# Altium project ovencontrol_0v2.PrjPCB
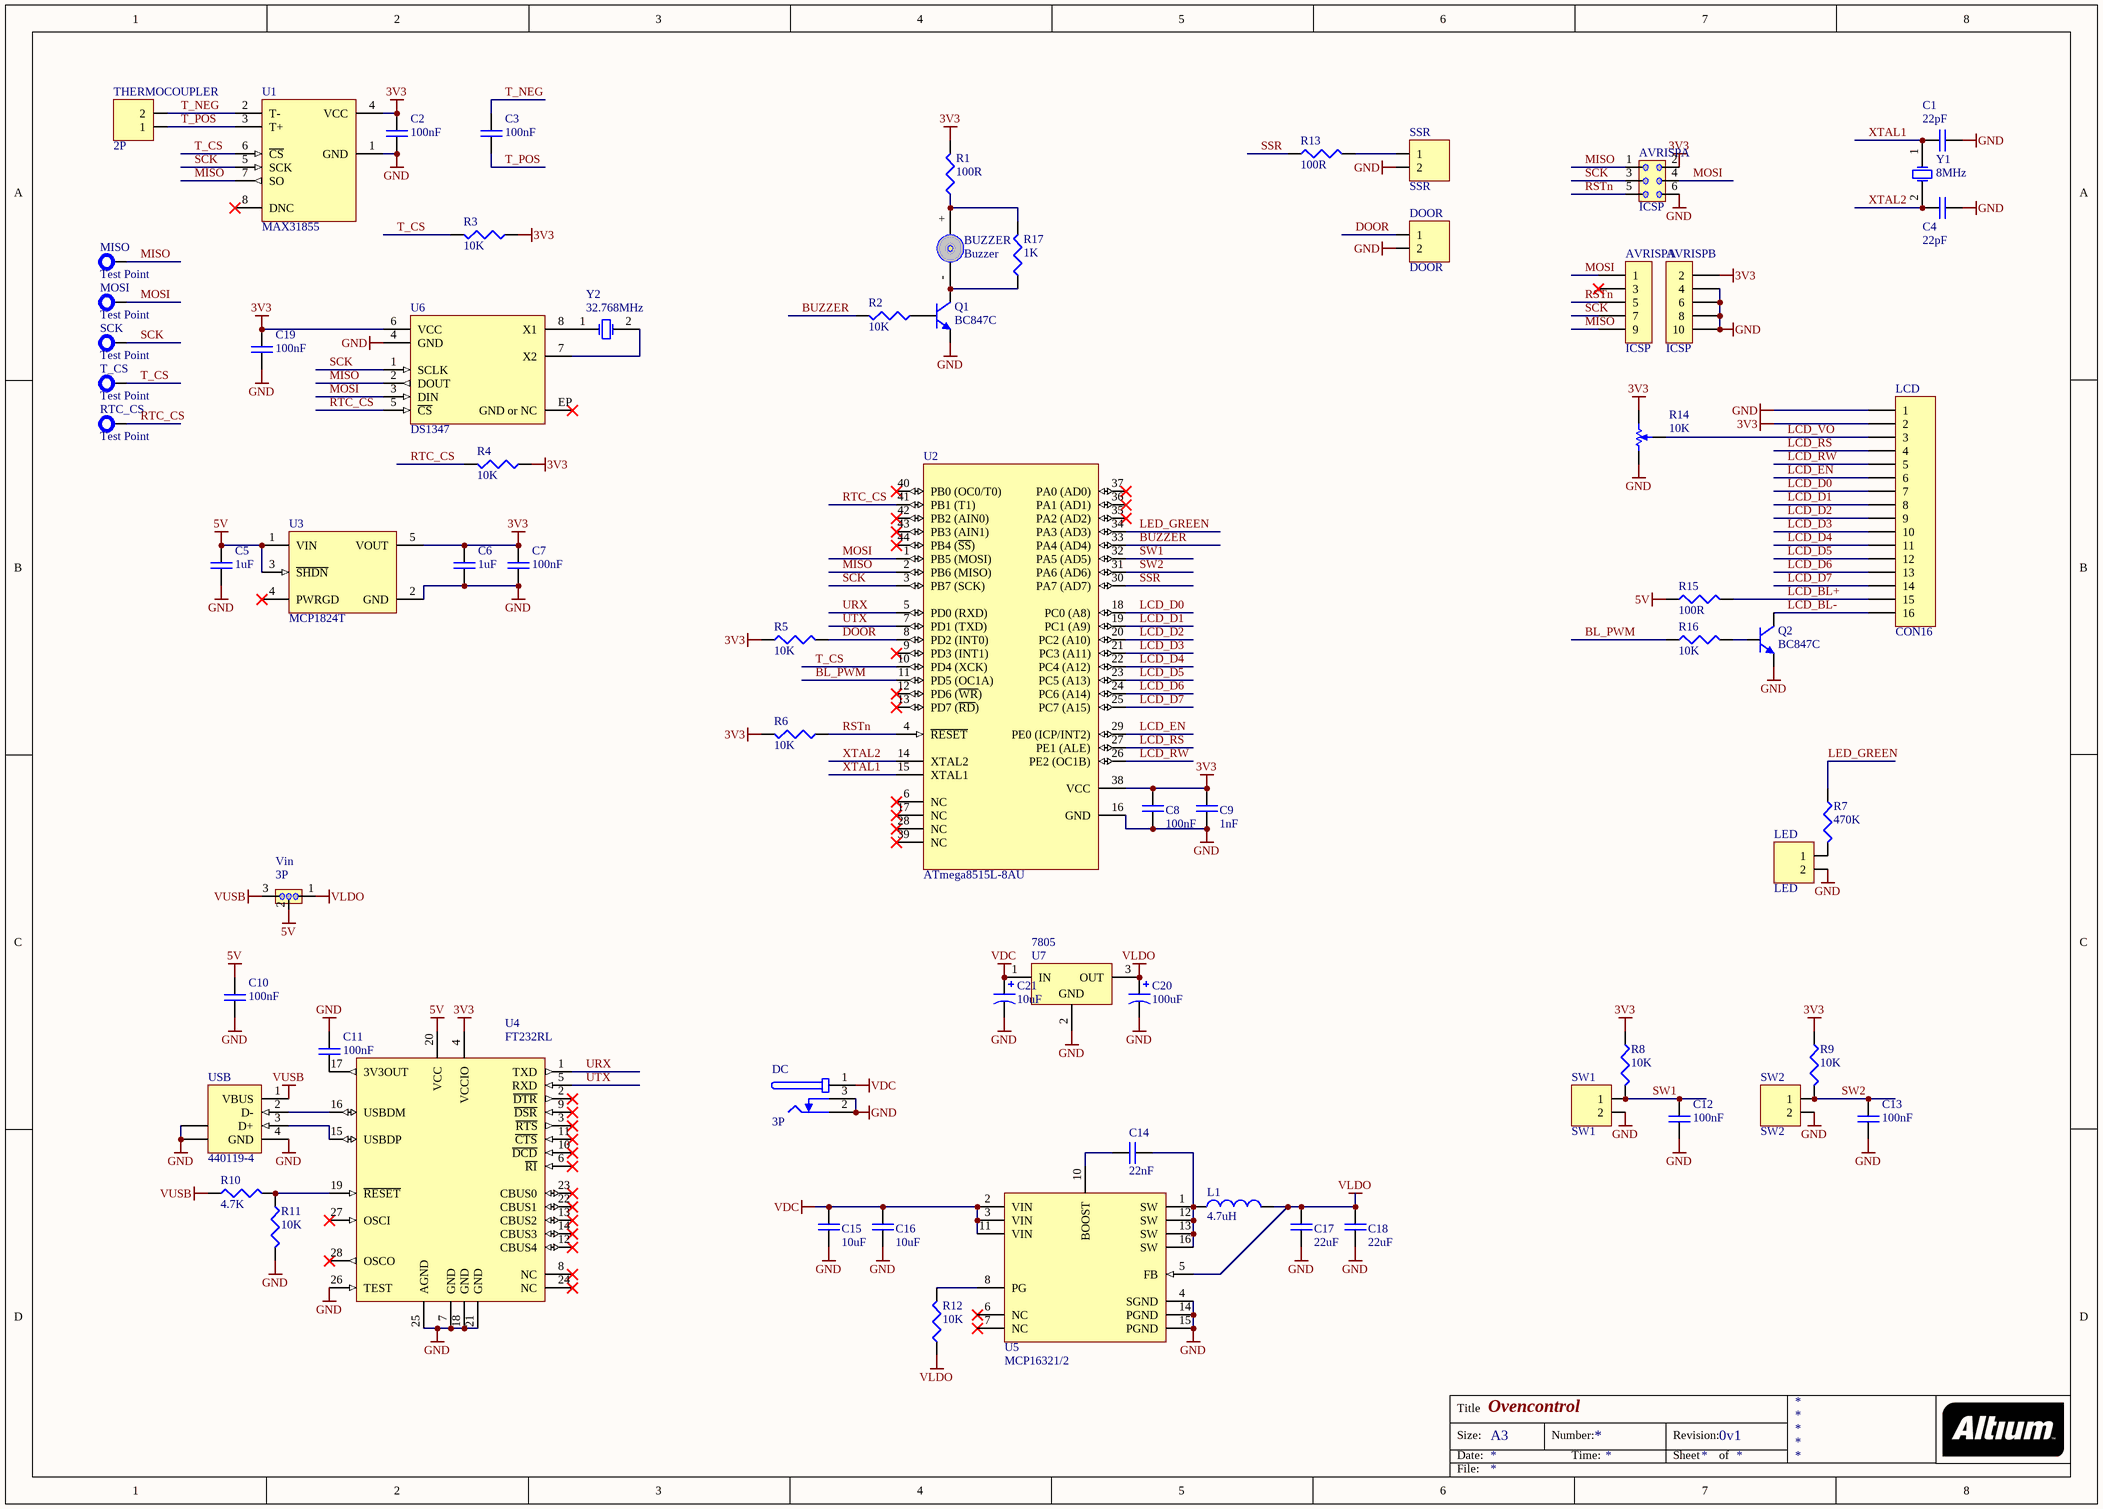
[diagram p0: ovencontrol.SchDoc]
1 sheet, 68 parts. Net scope: global (net labels, ports and power ports of the same name join across sheets).
Board file: ovencontrol.PcbDoc

## Sheet ovencontrol.SchDoc: Ovencontrol
size A3; Revision: 0v1; PageSetup: Record=PageOptions|CenterHorizontal=True|CenterVertical=True|PrintScale=1.00|XCorrection=1.00|YCorrection=1.00|PrintKind=1|BorderSize=5000000|LeftOffset=0|BottomOffset=0|Orientation=2|PaperLength=1000|PaperWidth=1000|Scale=100|PaperSource=7|PrintQuality=-4|MediaType=1|DitherType=10|PaperKind=A3|PrintScaleMode=1

### Parts
(Parts that share a designator on the sheet are numbered #1, #2 ... from top to bottom, then left to right.)
AVRISP#1  ICSP  [DIL-6]  (part A of 3)
AVRISP#2  ICSP  [IDC-10]  (parts A,B of 2)
BUZZER  Buzzer  [Buzzer_12mm]
C1  22pF  [0603]
C2  100nF  [0603]
C3  100nF  [0603]
C4  22pF  [0603]
C5  1uF  [0603]
C6  1uF  [0603]
C7  100nF  [0603]
C8  100nF  [0603]
C9  1nF  [0603]
C10  100nF  [0603]
C11  100nF  [0603]
C12  100nF  [0603]
C13  100nF  [0603]
C14  22nF  [0603]
C15  10uF  [0805]
C16  10uF  [0805]
C17  22uF  [0805]
C18  22uF  [0805]
C19  100nF  [0603]
C20  100uF  [RADIAL-2.5MM]
C21  10uF  [RADIAL-2.5MM]
DC  3P  [JACKPOW/PD-2.5MM-TH]
DOOR  DOOR  [SIP-2]
L1  4.7uH  [1210]
LCD  CON16  [HDR2X8]
LED  LED  [SIP-2]
MISO  Test Point  [TERMINAL]  (no BOM)
MOSI  Test Point  [TERMINAL]  (no BOM)
Q1  BC847C  [SOT-23@BEC]
Q2  BC847C  [SOT-23@BEC]
R1  100R  [0603]
R2  10K  [0603]
R3  10K  [0603]
R4  10K  [0603]
R5  10K  [0603]
R6  10K  [0603]
R7  470K  [0603]
R8  10K  [0603]
R9  10K  [0603]
R10  4.7K  [0603]
R11  10K  [0603]
R12  10K  [0603]
R13  100R  [0603]
R14  10K  [POT4MM-2]
R15  100R  [0603]
R16  10K  [0603]
R17  1K  [0603]
RTC_CS  Test Point  [TERMINAL]  (no BOM)
SCK  Test Point  [TERMINAL]  (no BOM)
SSR  SSR  [INTERLOCK2-5MM]
SW1  SW1  [SIP-2]
SW2  SW2  [SIP-2]
T_CS  Test Point  [TERMINAL]  (no BOM)
THERMOCOUPLER  2P  [INTERLOCK2-5MM]
U1  MAX31855  [SOIC-8]
U2  ATmega8515L-8AU  [TQFP-44]
U3  MCP1824T  [SOT-23-5]
U4  FT232RL  [SSOP-28]
U5  MCP16321/2  [QFN50P300X300-16V4L]
U6  DS1347  [TDFN-8]
U7  7805  [TO-220]
USB  440119-4  [440119]
Vin  3P  [SIP-3]
Y1  8MHz  [HC-49U]
Y2  32.768MHz  [XTAL-SMD-4.9x1.8]

### Nets
3V3: AVRISP#1.2 AVRISP#2.2 C2.1 C6.1 C7.1 C8.2 C9.2 C19.1 LCD.2 R1.2 R3.1 R4.1 R5.1 R6.1 R8.1 R9.1 R14.CW(+) U1.4(VCC) U2.38(VCC) U3.5(VOUT) U4.4(VCCIO) U6.6(VCC)
5V: C5.1 C10.1 R15.1 U3.1(VIN) U3.3(~{SHDN}) U4.20(VCC) Vin.2
GND: AVRISP#1.6 AVRISP#2.4 AVRISP#2.6 AVRISP#2.8 AVRISP#2.10 C1.1 C2.2 C4.1 C5.2 C6.2 C7.2 C8.1 C9.1 C10.2 C11.1 C12.2 C13.2 C15.2 C16.2 C17.2 C18.2 C19.2 C20.2(N) C21.2(N) DC.2 DC.3 DOOR.2 LCD.1 LED.2 Q1.E Q2.E R11.2 R14.CCW(-) SSR.2 SW1.2 SW2.2 U1.1(GND) U2.16(GND) U3.2(GND) U4.7(GND) U4.18(GND) U4.21(GND) U4.25(AGND) U4.26(TEST) U5.4(SGND) U5.14(PGND) U5.15(PGND) U6.4(GND) U7.2(GND) USB.4(GND) USB.5(SHLD) USB.6(SHLD)
VDC: C15.1 C16.1 C21.1(P) DC.1 U5.2(VIN) U5.3(VIN) U5.11(VIN) U7.1(IN)
VLDO: C17.1 C18.1 C20.1(P) L1.2 R12.2 U5.5(FB) U7.3(OUT) Vin.1
VUSB: R10.1 USB.1(VBUS) Vin.3
BL_PWM: R16.1 U2.11(PD5_(OC1A))
BUZZER: R2.2 U2.33(PA4_(AD4))
DOOR: DOOR.1 R5.2 U2.8(PD2_(INT0))
LCD_BL+: LCD.15 R15.2
LCD_BL-: LCD.16 Q2.C
LCD_D0: LCD.7 U2.18(PC0_(A8))
LCD_D1: LCD.8 U2.19(PC1_(A9))
LCD_D2: LCD.9 U2.20(PC2_(A10))
LCD_D3: LCD.10 U2.21(PC3_(A11))
LCD_D4: LCD.11 U2.22(PC4_(A12))
LCD_D5: LCD.12 U2.23(PC5_(A13))
LCD_D6: LCD.13 U2.24(PC6_(A14))
LCD_D7: LCD.14 U2.25(PC7_(A15))
LCD_EN: LCD.6 U2.29(PE0_(ICP/INT2))
LCD_RS: LCD.4 U2.27(PE1_(ALE))
LCD_RW: LCD.5 U2.26(PE2_(OC1B))
LCD_VO: LCD.3 R14.W
LED_GREEN: R7.1 U2.34(PA3_(AD3))
MISO: AVRISP#1.1 AVRISP#2.9 MISO.1(TP) U1.7(SO) U2.2(PB6_(MISO)) U6.2(DOUT)
MOSI: AVRISP#1.4 AVRISP#2.1 MOSI.1(TP) U2.1(PB5_(MOSI)) U6.3(DIN)
RSTn: AVRISP#1.5 AVRISP#2.5 R6.2 U2.4(~{RESET})
RTC_CS: R4.2 RTC_CS.1(TP) U2.41(PB1_(T1)) U6.5(~{CS})
SCK: AVRISP#1.3 AVRISP#2.7 SCK.1(TP) U1.5(SCK) U2.3(PB7_(SCK)) U6.1(SCLK)
SSR: R13.1 U2.30(PA7_(AD7))
SW1: C12.1 R8.2 SW1.1 U2.32(PA5_(AD5))
SW2: C13.1 R9.2 SW2.1 U2.31(PA6_(AD6))
T_CS: R3.2 T_CS.1(TP) U1.6(~{CS}) U2.10(PD4_(XCK))
T_NEG: C3.1 THERMOCOUPLER.2 U1.2(T-)
T_POS: C3.2 THERMOCOUPLER.1 U1.3(T+)
URX: U2.5(PD0_(RXD)) U4.1(TXD)
UTX: U2.7(PD1_(TXD)) U4.5(RXD)
XTAL1: C1.2 U2.15(XTAL1) Y1.1(OSC1)
XTAL2: C4.2 U2.14(XTAL2) Y1.2(OSC2)
NetBUZZER_+: BUZZER.+ R1.1 R17.2
NetBUZZER_-: BUZZER.- Q1.C R17.1
NetC11_2: C11.2 U4.17(3V3OUT)
NetC14_1: C14.1 U5.10(BOOST)
NetC14_2: C14.2 L1.1 U5.1(SW) U5.12(SW) U5.13(SW) U5.16(SW)
NetLED_1: LED.1 R7.2
NetQ1_B: Q1.B R2.1
NetQ2_B: Q2.B R16.2
NetR10_2: R10.2 R11.1 U4.19(~{RESET})
NetR12_1: R12.1 U5.8(PG)
NetR13_2: R13.2 SSR.1
NetU4_15: U4.15(USBDP) USB.3(D+)
NetU4_16: U4.16(USBDM) USB.2(D-)
NetU6_7: U6.7(X2) Y2.2(OSC2)
NetU6_8: U6.8(X1) Y2.1(OSC1)

Not connected (* = marked no-connect by the designer): AVRISP#2 3*; U1 8(DNC)*; U2 6(NC)* 9(PD3_(INT1))* 12(PD6_(~{WR}))* 13(PD7_(~{RD}))* 17(NC)* 28(NC)* 35(PA2_(AD2))* 36(PA1_(AD1))* 37(PA0_(AD0))* 39(NC)* 40(PB0_(OC0/T0))* 42(PB2_(AIN0))* 43(PB3_(AIN1))* 44(PB4_(~{SS}))*; U3 4(PWRGD)*; U4 2(~{DTR})* 3(~{RTS})* 6(~{RI})* 8(NC)* 9(~{DSR})* 10(~{DCD})* 11(~{CTS})* 12(CBUS4)* 13(CBUS2)* 14(CBUS3)* 22(CBUS1)* 23(CBUS0)* 24(NC)* 27(OSCI)* 28(OSCO)*; U5 6(NC)* 7(NC)*; U6 EP(GND_or_NC)*

### Notes on the sheet
- Title
- Size:
- Date:
- A3
- Number:
- Time:
- Revision:
- Sheet
- of
- File:

### Library data of the parts
AVRISP#1 = JMP6: 6-Pin Jumper; Sub-Type: Connector; Owner: Rui Rebelo; Assembly: INS; Creation Date: 2005-07-17; Status: Valid; Validation Date: 2006-05-15; Type: Electrical & Mechanical
AVRISP#2 = CON10: Connector 10 Pins; Owner: António Silva; Assembly: INS; Sub-Type: Connector; Creation Date: 2005-11-21; Status: Valid; Validation Date: 2006-05-15; Type: Electrical & Mechanical
BUZZER = Buzzer: Transductor
C1-C19 = CAP: Capacitor; Owner: Nuno Brum; Sub-Type: Ceramic; Assembly: INS; Maximum Voltage: *; Creation Date: 2005-04-28; Status: Valid; Validation date: 2006-05-15; Type: Capacitor
C20 C21 = CAP POL: Polarized Capacitor; Owner: Nuno Brum; Sub-Type: Tantalum; Assembly: INS; Validation date: 2006-05-15; Creation Date: 2005-04-28; Status: Valid; Type: Capacitor
DC = JACK POWER PD: Jack Power with insertion detect; Sub-Type: Connector; Owner: Gonçalo Costa; Assembly: INS; Creation Date: 2005-12-05; Status: New; Type: Electrical & Mechanical
DOOR LED SSR SW1 SW2 THERMOCOUPLER = CON02: Connector 2 pins; Owner: Rui Rebelo; Assembly: INS; Sub-Type: Connector; Creation Date: 2005-05-27; Status: Valid; Validation Date: 2006-05-15; Type: Electrical & Mechanical
L1 = IND: Inductor; Owner: Nuno Brum; Sub-Type: Generic; Assembly: INS; Validation date: 2006-05-15; Creation Date: 2002-07-17; Status: Valid; Type: Inductor
LCD = CON16: Header, 16-Pin; LatestRevisionDate: 17-Jul-2002; LatestRevisionNote: Re-released for DXP Platform.; Publisher: Altium Limited
MISO MOSI RTC_CS SCK T_CS = TEST-PROBE: Test/Probe Point; Owner: Nuno Brum; Sub-Type: Mechanical; Assembly: PCB; Validation Date: 2006-05-15; Type: PCB; Creation Date: 2005-06-01; Status: Valid
Q1 Q2 = NPN: NPN General Purpose Transistor; Owner: Nuno Brum; Sub-Type: Bipolar; Assembly: INS; Validation date: 2006-05-15; Creation Date: 2001-06-05; Status: Valid; Model: BC847C; Type: Transistor
R1-R13 R15-R17 = RES: Resistor; Owner: Nuno Brum; Sub-Type: Generic; Assembly: INS; Validation date: 2006-05-15; Creation Date: 2002-07-17; Status: Valid; Power: *; Type: Resistor
R14 = RES Pot: Square Trimming Potentiometer; Published: 17-Dec-2003; DatasheetVersion: Oct-2003; PackageReference: POT4MM-2; Publisher: Altium Limited; PackageDescription: Square Trimming Potentiometer; ComponentLink1Description: Manufacturer Link; ComponentLink1URL: http://bourns.com/2/search.html
U1 = MAX31855: Cold-Junction Compensated Thermocouple-to-Digital Converter
U2 = ATmega8515L-8AU: 8-bit AVR Microcontroller, 8KB Flash, 512 Bytes EEPROM, 512 Bytes SRAM, 2.7-5.5V, 44-pin TQFP, Industrial Grade (-40°C to 85°C); Published: 1-Apr-2010; DatasheetVersion: revK, Jan-2010; PackageVersion: rev.B, Oct-2001; PackageReference: 44A; Publisher: Altium Limited; PackageDescription: 44-Pin Plastic Thin Profile Quad Flat Pack, 10 x 10 x 1.0 mm Body, 0.8 mm Pitch (TQFP); Supplier 1: Digi-Key; Supplier Part Number 1: ATMEGA8515L-8AU-ND; Supplier 2: Farnell; Supplier Part Number 2: 9171410; Supplier 3: Farnell; Supplier Part Number 3: 1528435; Supplier 4: Mouser; Supplier Part Number 4: 556-ATMEGA8515L-8AU; ComponentLink1Description: Manufacturer Link; ComponentLink1URL: http://www.atmel.com/products/avr/default.asp?; ComponentLink2Description: ATmega8515(L) Datasheet; ComponentLink2URL: http://www.atmel.com/dyn/resources/prod_documents/doc2512.pdf; ComponentLink3Description: ATmega8515(L) Summary; ComponentLink3URL: http://www.atmel.com/dyn/resources/prod_documents/2512S.pdf; ComponentLink4Description: Atmel.com Home; ComponentLink4URL: http://www.atmel.com
U3 = MCP1824T: 300 mA, Low Voltage, Low Quiescent Current LDO Regulator, 5-Pin SOT-23, Extended Temperature, Tape and Reel; Published: 29-Jan-2009; DatasheetVersion: revA, Aug-2007; PackageVersion: revBB, Aug-2009; PackageReference: SOT-23-OT5; Publisher: Altium Limited; PackageDescription: 5-Lead Plastic Small Outline Transistor (OT) [SOT-23]; Supplier 1: Digi-Key; Supplier Part Number 1: MCP1824T-3302E/OTTR-ND; Supplier 2: Digi-Key; Supplier Part Number 2: MCP1824T-3302E/OTCT-ND; Supplier 3: Digi-Key; Supplier Part Number 3: MCP1824T-3302E/OTDKR-ND; Supplier 4: Farnell; Supplier Part Number 4: 1578387; Code_IPC: SOT23-5; ComponentLink1Description: Datasheet; ComponentLink1URL: http://ww1.microchip.com/downloads/en/DeviceDoc/22070a.pdf; ComponentLink2Description: Packaging Specification; ComponentLink2URL: http://www.microchip.com/stellent/groups/techpub_sg/documents/packagingspec/en012702.pdf; ComponentLink3Description: Microchip.com Home; ComponentLink3URL: http://www.microchip.com/
U4 = FT232RL: USB UART Asynchronous Serial Data Transfer Chip, SSOP-28, Tube; Published: 19-Aug-2010; DatasheetVersion: ver 2.07, Jul-2010; PackageVersion: 2010; PackageReference: SSOP-28; Publisher: Altium Limited; PackageDescription: 28-Pin Small Outline Package 0.65 mm Pitch; ComponentLink1Description: Manufacturer Link; ComponentLink1URL: http://www.ftdichip.com/Products/ICs/FT232R.htm; ComponentLink2Description: Datasheet; ComponentLink2URL: http://www.ftdichip.com/Support/Documents/DataSheets/ICs/DS_FT232R.pdf
U5 = MCP16321/2: 24V Input, 1A/2A Output, High Efficiency Synchronous Buck Regulator  with Power Good Indicatio
U6 = DS1347: Low-Current, SPI-Compatible Real-Time Clock
U7 = 78xx regulator: 3-Terminal Medium-Current Positive Fixed Voltage Regulator; Note: Pin 2 is electrically connected to TAB; Published: 17-Jul-2002; DatasheetVersion: 1988; PackageReference: 221A-04; Publisher: Altium Limited; PackageDescription: TO, Thru-Hole, Vertical, Heatsink Mounted; 3 In-Line Leads; Pitch 2.54 mm; Code_JEDEC: TO-262-AA; ComponentLink1Description: Manufacturer Link; ComponentLink1URL: http://www.onsemi.com/site/products/taxonomy/0,4438,503,00.html; ComponentLink2Description: Datasheet; ComponentLink2URL: http://www.onsemi.com/pub/Collateral/MC78M00-D.PDF
USB = 440119-4: USB 1.1, Right Angle, Thru-Hole, B Type, Receptacle, 4 Position, Black; ContactMaterial: Copper Alloy; ContactPlating: Gold (5) over Nickel; TerminationLength: 2.84mm [0.112in.]; PCB_Layout: Complies with manufacturer's recommendation.; DrillSize: Corresponds to nominal value.; PanelGround: Without; Published: 15-Jul-2004; DatasheetDocument: 12-Jan-2004; PackageDocument: 12-Jan-2004; PackageReference: 440119; Publisher: Altium Limited; HousingMaterial: Thermoplastic; ComponentLink1Description: Manufacturer Link; ComponentLink1URL: http://www.tycoelectronics.com/; ComponentLink2Description: Packaging Specification; ComponentLink2URL: http://ecommas.tycoelectronics.com/commerce/DocumentDelivery/DDEController?Action=showdoc&DocId=Customer+Drawing%7F440119%7FC%7Ftif%7FEnglish%7FC_440119_C.tif
Vin = JMP3: 3-Jumper; Owner: Nuno Brum; Sub-Type: Connector; STATE1: 0; Assembly: INS; Validation Date: 2006-05-15; Creation Date: 2002-07-17; Status: Valid; Type: Electrical & Mechanical
Y1 Y2 = Crystal Oscillator: Published: 17-Jul-2002; DatasheetDocument: 18-Apr-2000; PackageReference: CSM-7; Publisher: Altium Limited; ComponentLink1Description: Manufacturer Link; ComponentLink1URL: http://www.ecsxtal.com/; ComponentLink2Description: Datasheet; ComponentLink2URL: http://www.ecsxtal.com/pdf3/CSM_7.pdf